# Altium schematic sheet MODEM_PT1.SchDoc: EC200U, SIM, USB, ANT
size 420 x 297 mm; SheetNumber: 3
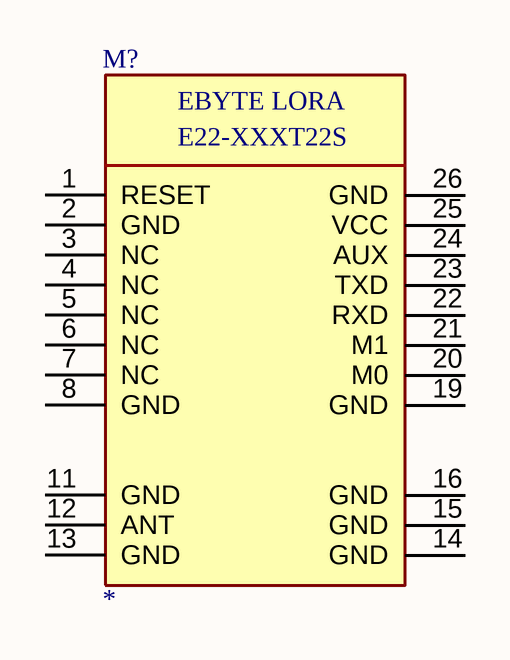
[diagram p0: MODEM_PT1.SchDoc]

## Parts
M?  E22-XXXT22S  [E22-XXXT22S]  (value not drawn)

## Nets

Not connected (* = marked no-connect by the designer): M? 1(RESET) 2(GND) 3(NC) 4(NC) 5(NC) 6(NC) 7(NC) 8(GND) 11(GND) 12(ANT) 13(GND) 14(GND) 15(GND) 16(GND) 19(GND) 20(M0) 21(M1) 22(RXD) 23(TXD) 24(AUX) 25(VCC) 26(GND)

## Notes on the sheet
- PROJECT
- SIZE
- FILE NAME
- A3
- TITLE
- SHEET
- OF
- REV
- (in symbol E22-XXXT22S) EBYTE LORA

## Library data of the parts
M? = E22-XXXT22S: E22 EByte LoRa Module; Manufacturer 1: *; Manufacturer Part Number 1: *; Value: *